# EAGLE design main (EAGLE 9.2.2)
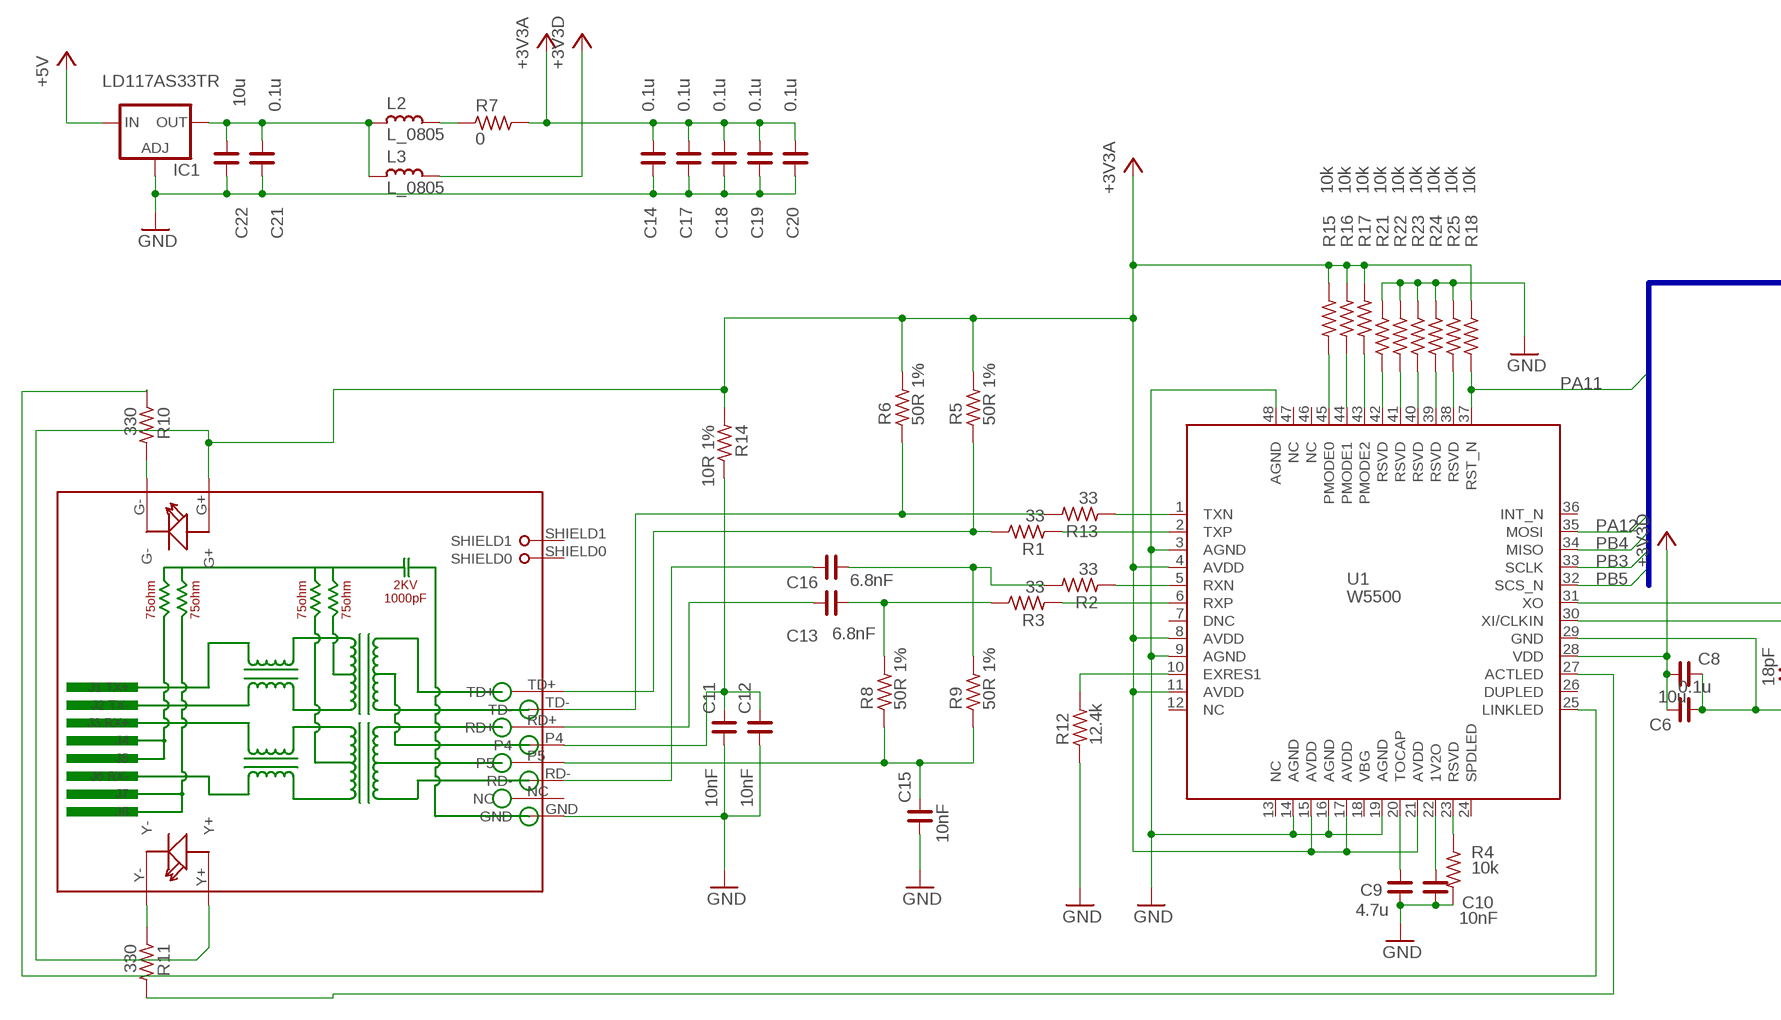
[diagram p0: schematic, sheet 1, part 1 of 2]
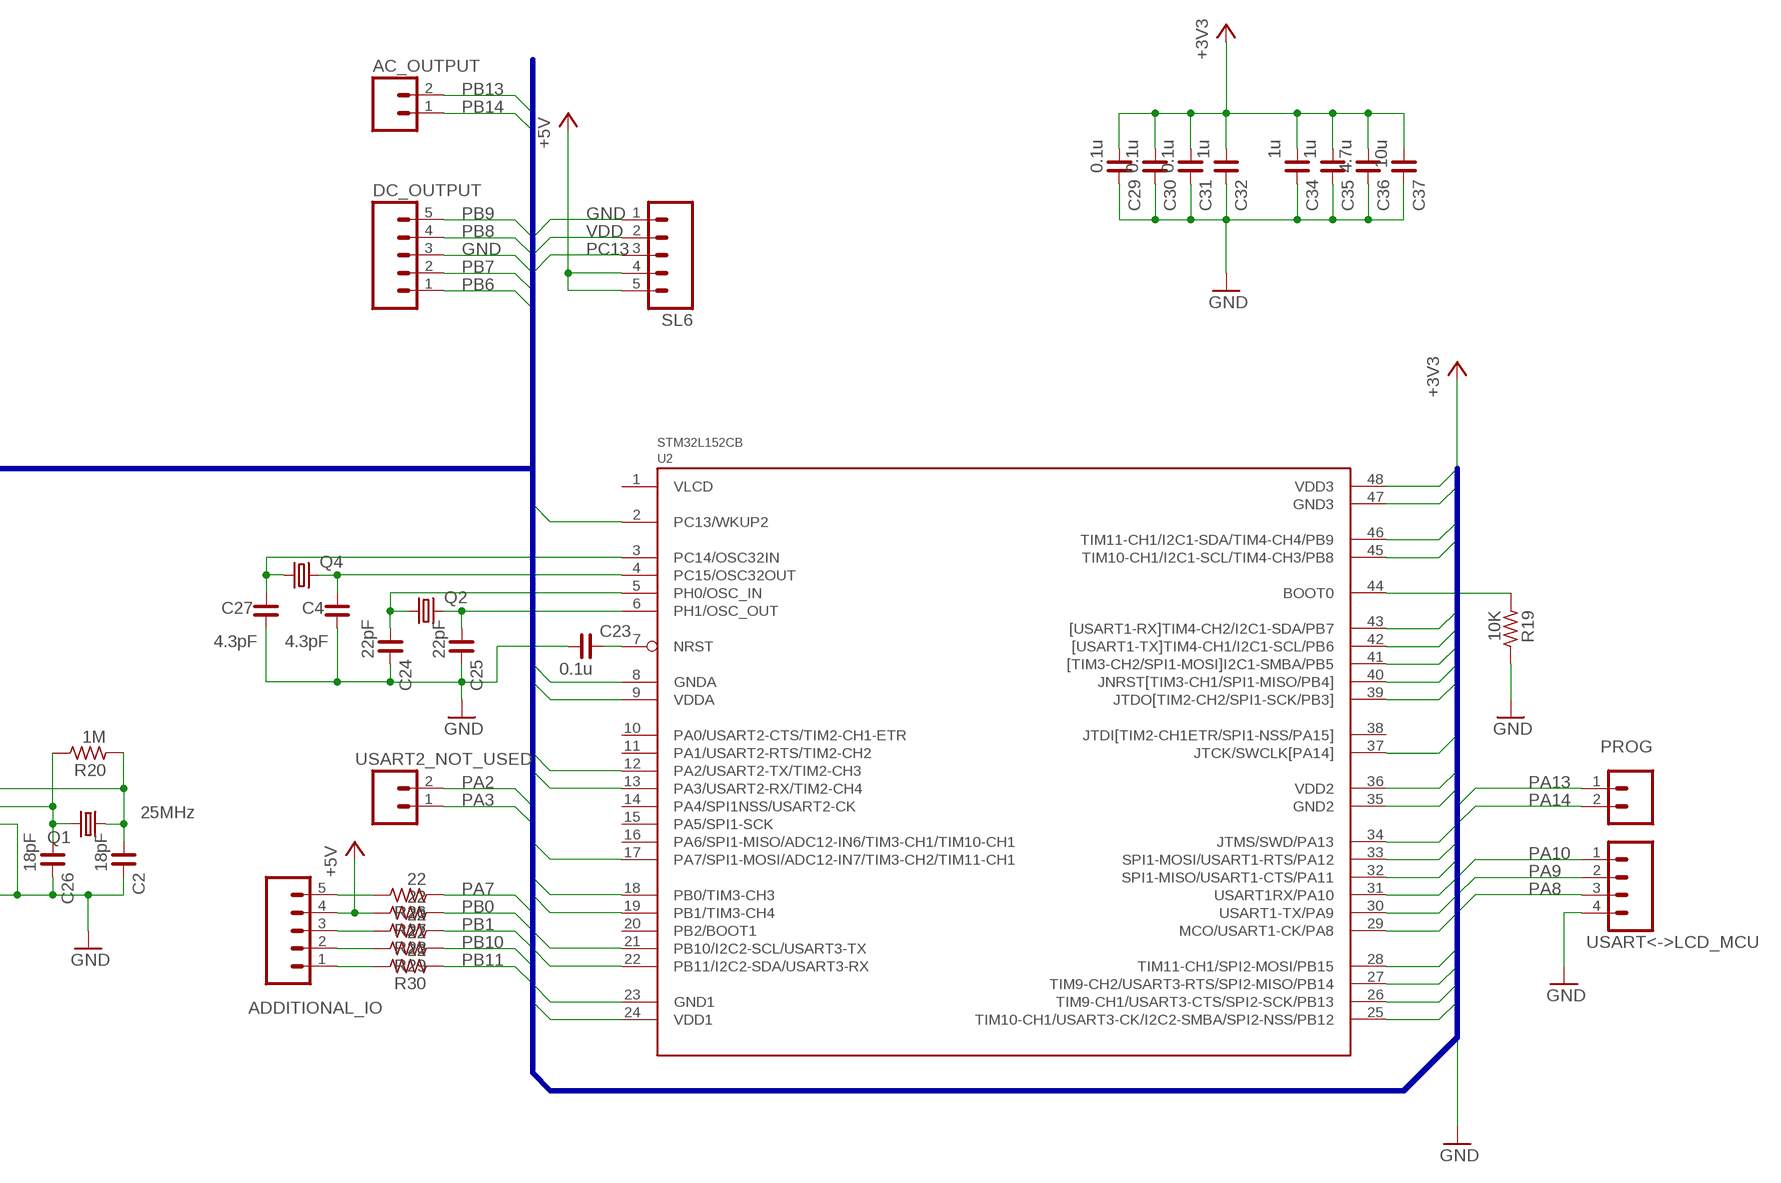
[diagram p1: schematic, sheet 1, part 2 of 2]

## Parts
AC_OUTPUT  M02  [02P]
ADDITIONAL_IO  M05  [05P]
C2  18pF  C_0603  [C0603]
C4  4.3pF  C_0603  [C0603]
C6  0.1u  C_0805  [C0805]
C8  10u  C_0805  [C0805]
C9  4.7u  C_0805  [C0805]
C10  10nF  C_0603  [C0603]
C11  10nF  C_0603  [C0603]
C12  10nF  C_0603  [C0603]
C13  6.8nF  C_0603  [C0603]
C14  0.1u  C_0805  [C0805]
C15  10nF  C_0603  [C0603]
C16  6.8nF  C_0603  [C0603]
C17  0.1u  C_0805  [C0805]
C18  0.1u  C_0805  [C0805]
C19  0.1u  C_0805  [C0805]
C20  0.1u  C_0805  [C0805]
C21  0.1u  C_0805  [C0805]
C22  10u  C_0805  [C0805]
C23  0.1u  C_0805  [C0805]
C24  22pF  C_0805  [C0805]
C25  22pF  C_0805  [C0805]
C26  18pF  C_0603  [C0603]
C27  4.3pF  C_0603  [C0603]
C29  0.1u  C_0805  [C0805]
C30  0.1u  C_0805  [C0805]
C31  0.1u  C_0805  [C0805]
C32  1u  C_0805  [C0805]
C34  1u  C_0805  [C0805]
C35  1u  C_0805  [C0805]
C36  4.7u  C_0805  [C0805]
C37  10u  C_0805  [C0805]
DC_OUTPUT  M05  [05P]
IC1  LD117AS33TR  [SOT223]
L2  L_0805  [L0805]
L3  L_0805  [L0805]
PROG  M02  [02P]
Q1  25MHz  CRYSTALHC49U-V  [HC49U-V]
Q2  CRYSTALHC49U-V  [HC49U-V]
Q4  CRYSTALTC26H  [TC26H]
R1  33  R_0603  [R0603]
R2  33  R_0603  [R0603]
R3  33  R_0603  [R0603]
R4  10k  R_0603  [R0603]
R5  50R 1%  R_0603  [R0603]
R6  50R 1%  R_0603  [R0603]
R7  0  R_1206  [R1206]
R8  50R 1%  R_0603  [R0603]
R9  50R 1%  R_0603  [R0603]
R10  330  R_0805  [R0805]
R11  330  R_0805  [R0805]
R12  12.4k  R_0805  [R0805]
R13  33  R_0603  [R0603]
R14  10R 1%  R_0603  [R0603]
R15  10k  R_0603  [R0603]
R16  10k  R_0603  [R0603]
R17  10k  R_0603  [R0603]
R18  10k  R_0603  [R0603]
R19  10K  R_1206  [R1206]
R20  1M  R_0805  [R0805]
R21  10k  R_0603  [R0603]
R22  10k  R_0603  [R0603]
R23  10k  R_0603  [R0603]
R24  10k  R_0603  [R0603]
R25  10k  R_0603  [R0603]
R26  22  R_0805  [R0805]
R27  22  R_0805  [R0805]
R28  22  R_0805  [R0805]
R29  22  R_0805  [R0805]
R30  22  R_0805  [R0805]
RJ1  HR911105A  [HR911105A]
SL6  M05  [05P]
U1  W5500  [W5500]
U2  STM32L152CB  [LQFP48-7X7]
USART2_NOT_USED  M02  [02P]
USART<->LCD_MCU  M04  [04P]

## Nets
+3V3A: C14.1 C17.1 C18.1 C19.1 C20.1 R5.2 R6.2 R7.2 R14.1 R15.2 R16.2 R17.2 R18.2 RJ1.G+ RJ1.Y+ U1.4(AVDD) U1.8(AVDD) U1.11(AVDD) U1.15(AVDD) U1.17(AVDD) U1.21(AVDD)
+3V3D: C6.2 C8.1 L3.1 U1.28(VDD)
+5V: ADDITIONAL_IO.4 IC1.3(IN) R27.2 SL6.4 SL6.5
GND: C2.2 C4.1 C6.1 C8.2 C9.2 C10.1 C11.1 C12.1 C14.2 C15.1 C17.2 C18.2 C19.2 C20.2 C21.2 C22.2 C23.1 C24.2 C25.2 C26.2 C27.1 C29.2 C30.2 C31.2 C32.2 C34.2 C35.2 C36.2 C37.2 DC_OUTPUT.3 IC1.1(ADJ) R4.2 R12.1 R19.2 R21.2 R22.2 R23.2 R24.2 R25.2 RJ1.GND SL6.1 U1.3(AGND) U1.9(AGND) U1.14(AGND) U1.16(AGND) U1.19(AGND) U1.29(GND) U1.48(AGND) U2.8(GNDA) U2.23(GND1) U2.35(GND2) U2.47(GND3) USART<->LCD_MCU.4
N$1: C9.1 U1.20(TOCAP)
N$2: C10.2 U1.22(1V2O)
N$3: R13.1 U1.1(TXN)
N$4: C2.1 Q1.1 R20.1 U1.31(XO)
N$5: C26.1 Q1.2 R20.2 U1.30(XI/CLKIN)
N$6: R1.1 U1.2(TXP)
N$7: R2.1 U1.5(RXN)
N$8: R3.1 U1.6(RXP)
N$9: R4.1 U1.23(RSVD)
N$10: C21.1 C22.1 IC1.4(OUT) L2.2 L3.2
N$11: C16.1 R2.2 R9.2
N$12: C13.1 R3.2 R8.2
N$13: L2.1 R7.1
N$14: R10.2 RJ1.G-
N$15: C11.2 C12.2 R14.2 RJ1.P4
N$16: R11.1 RJ1.Y-
N$17: R6.1 R13.2 RJ1.TD-
N$18: C13.2 RJ1.RD+
N$19: R10.1 U1.25(LINKLED)
N$20: R11.2 U1.27(ACTLED)
N$21: R16.1 U1.44(PMODE1)
N$22: R15.1 U1.45(PMODE0)
N$23: R17.1 U1.43(PMODE2)
N$24: C16.2 RJ1.RD-
N$25: R12.2 U1.10(EXRES1)
N$26: R1.2 R5.1 RJ1.TD+
N$27: C15.2 R8.1 R9.1 RJ1.P5
N$28: ADDITIONAL_IO.5 R26.2
N$29: C23.2 U2.7(NRST)
N$31: R19.1 U2.44(BOOT0)
N$32: C27.2 Q4.1 U2.3(PC14/OSC32IN)
N$33: C24.1 Q2.1 U2.5(PH0/OSC_IN)
N$34: C25.1 Q2.2 U2.6(PH1/OSC_OUT)
N$35: C4.2 Q4.2 U2.4(PC15/OSC32OUT)
N$36: ADDITIONAL_IO.3 R28.2
N$37: ADDITIONAL_IO.2 R29.2
N$38: R21.1 U1.42(RSVD)
N$39: R22.1 U1.41(RSVD)
N$40: R23.1 U1.40(RSVD)
N$41: R24.1 U1.39(RSVD)
N$42: R25.1 U1.38(RSVD)
N$43: ADDITIONAL_IO.1 R30.2
PA2: U2.12(PA2/USART2-TX/TIM2-CH3) USART2_NOT_USED.2
PA3: U2.13(PA3/USART2-RX/TIM2-CH4) USART2_NOT_USED.1
PA7: R26.1 U2.17(PA7/SPI1-MOSI/ADC12-IN7/TIM3-CH2/TIM11-CH1)
PA8: U2.29(MCO/USART1-CK/PA8) USART<->LCD_MCU.3
PA9: U2.30(USART1-TX/PA9) USART<->LCD_MCU.2
PA10: U2.31(USART1RX/PA10) USART<->LCD_MCU.1
PA11: R18.1 U1.37(RST_N) U2.32(SPI1-MISO/USART1-CTS/PA11)
PA12: U1.35(MOSI) U2.33(SPI1-MOSI/USART1-RTS/PA12)
PA13: PROG.1 U2.34(JTMS/SWD/PA13)
PA14: PROG.2 U2.37(JTCK/SWCLK[PA14])
PB0: R27.1 U2.18(PB0/TIM3-CH3)
PB1: R28.1 U2.19(PB1/TIM3-CH4)
PB3: U1.33(SCLK) U2.39(JTDO[TIM2-CH2/SPI1-SCK/PB3])
PB4: U1.34(MISO) U2.40(JNRST[TIM3-CH1/SPI1-MISO/PB4])
PB5: U1.32(SCS_N) U2.41([TIM3-CH2/SPI1-MOSI]I2C1-SMBA/PB5)
PB6: DC_OUTPUT.1 U2.42([USART1-TX]TIM4-CH1/I2C1-SCL/PB6)
PB7: DC_OUTPUT.2 U2.43([USART1-RX]TIM4-CH2/I2C1-SDA/PB7)
PB8: DC_OUTPUT.4 U2.45(TIM10-CH1/I2C1-SCL/TIM4-CH3/PB8)
PB9: DC_OUTPUT.5 U2.46(TIM11-CH1/I2C1-SDA/TIM4-CH4/PB9)
PB10: R29.1 U2.21(PB10/I2C2-SCL/USART3-TX)
PB11: R30.1 U2.22(PB11/I2C2-SDA/USART3-RX)
PB12: U2.25(TIM10-CH1/USART3-CK/I2C2-SMBA/SPI2-NSS/PB12)
PB13: AC_OUTPUT.2 U2.26(TIM9-CH1/USART3-CTS/SPI2-SCK/PB13)
PB14: AC_OUTPUT.1 U2.27(TIM9-CH2/USART3-RTS/SPI2-MISO/PB14)
PB15: U2.28(TIM11-CH1/SPI2-MOSI/PB15)
PC13: SL6.3 U2.2(PC13/WKUP2)
VDD: C29.1 C30.1 C31.1 C32.1 C34.1 C35.1 C36.1 C37.1 SL6.2 U2.9(VDDA) U2.24(VDD1) U2.36(VDD2) U2.48(VDD3) ; supply symbol labelled +3V3
Unconnected: RJ1.NC RJ1.SHIELD0 RJ1.SHIELD1 U1.7(DNC) U1.12(NC) U1.13(NC) U1.18(VBG) U1.24(SPDLED) U1.26(DUPLED) U1.36(INT_N) U1.46(NC) U1.47(NC) U2.1(VLCD) U2.10(PA0/USART2-CTS/TIM2-CH1-ETR) U2.11(PA1/USART2-RTS/TIM2-CH2) U2.14(PA4/SPI1NSS/USART2-CK) U2.15(PA5/SPI1-SCK) U2.16(PA6/SPI1-MISO/ADC12-IN6/TIM3-CH1/TIM10-CH1) U2.20(PB2/BOOT1) U2.38(JTDI[TIM2-CH1ETR/SPI1-NSS/PA15])

## Buses
VDD,GND,PA[0..15],PB[0..15],PC13

## Library data of the parts
AC_OUTPUT PROG USART2_NOT_USED = con-amp-quick:M02: AMP QUICK CONNECTOR; OC_FARNELL: unknown; OC_NEWARK: unknown
ADDITIONAL_IO DC_OUTPUT SL6 = con-amp-quick:M05: AMP QUICK CONNECTOR; OC_FARNELL: unknown; OC_NEWARK: unknown
C2 C4 C6 C8-C27 C29-C32 C34-C37 = rc-master-smd:C_: NON-POLARIZED CAP
IC1 = v-reg:LD117A?*: Low drop fixed and adjustable positive voltage regulators 1 A Source: http://www.st.com/stonline/products/literature/ds/7194/ld1117axx.pdf
L2 L3 = rc-master-smd:L_: INDUCTOR
Q1 Q2 = crystal:CRYSTAL: CRYSTAL; OC_FARNELL: 1666969; OC_NEWARK: unknown
Q4 = crystal:CRYSTAL: CRYSTAL; OC_FARNELL: unknown; OC_NEWARK: unknown
R1-R30 = rc-master-smd:R_: RESISTOR
RJ1 = CONNECTER:HR911105A
U1 = W5500:W5500
U2 = stm32:STM32L152CB
USART<->LCD_MCU = con-amp-quick:M04: AMP QUICK CONNECTOR; OC_FARNELL: unknown; OC_NEWARK: unknown

## Board
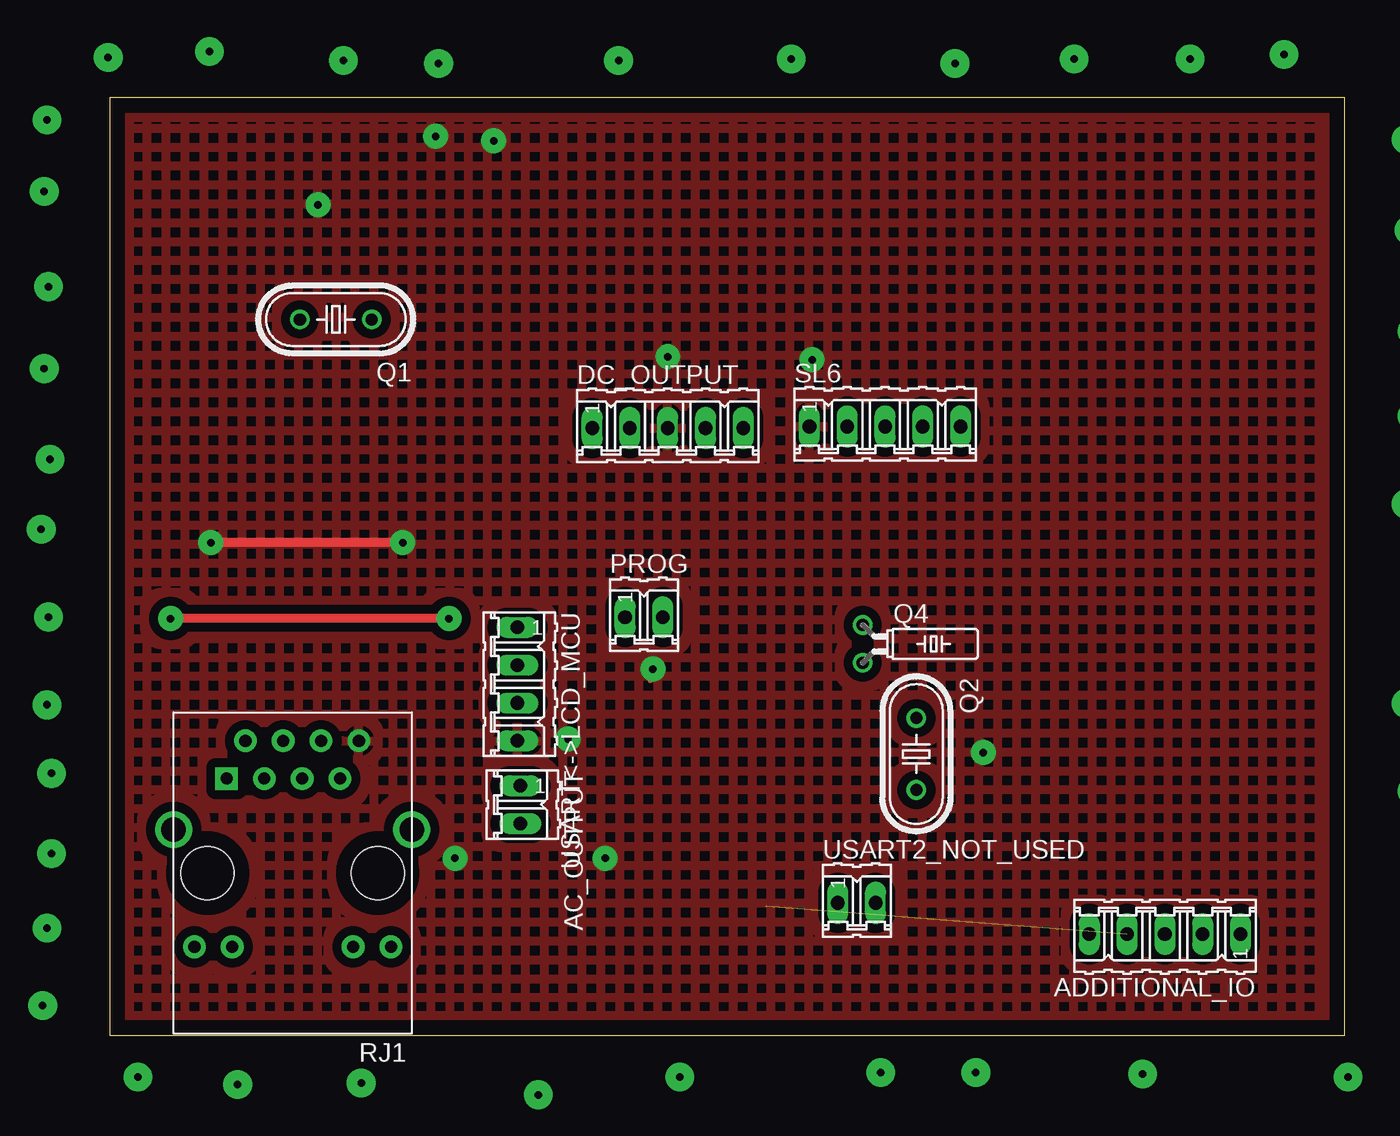
[diagram p2: board, top side]
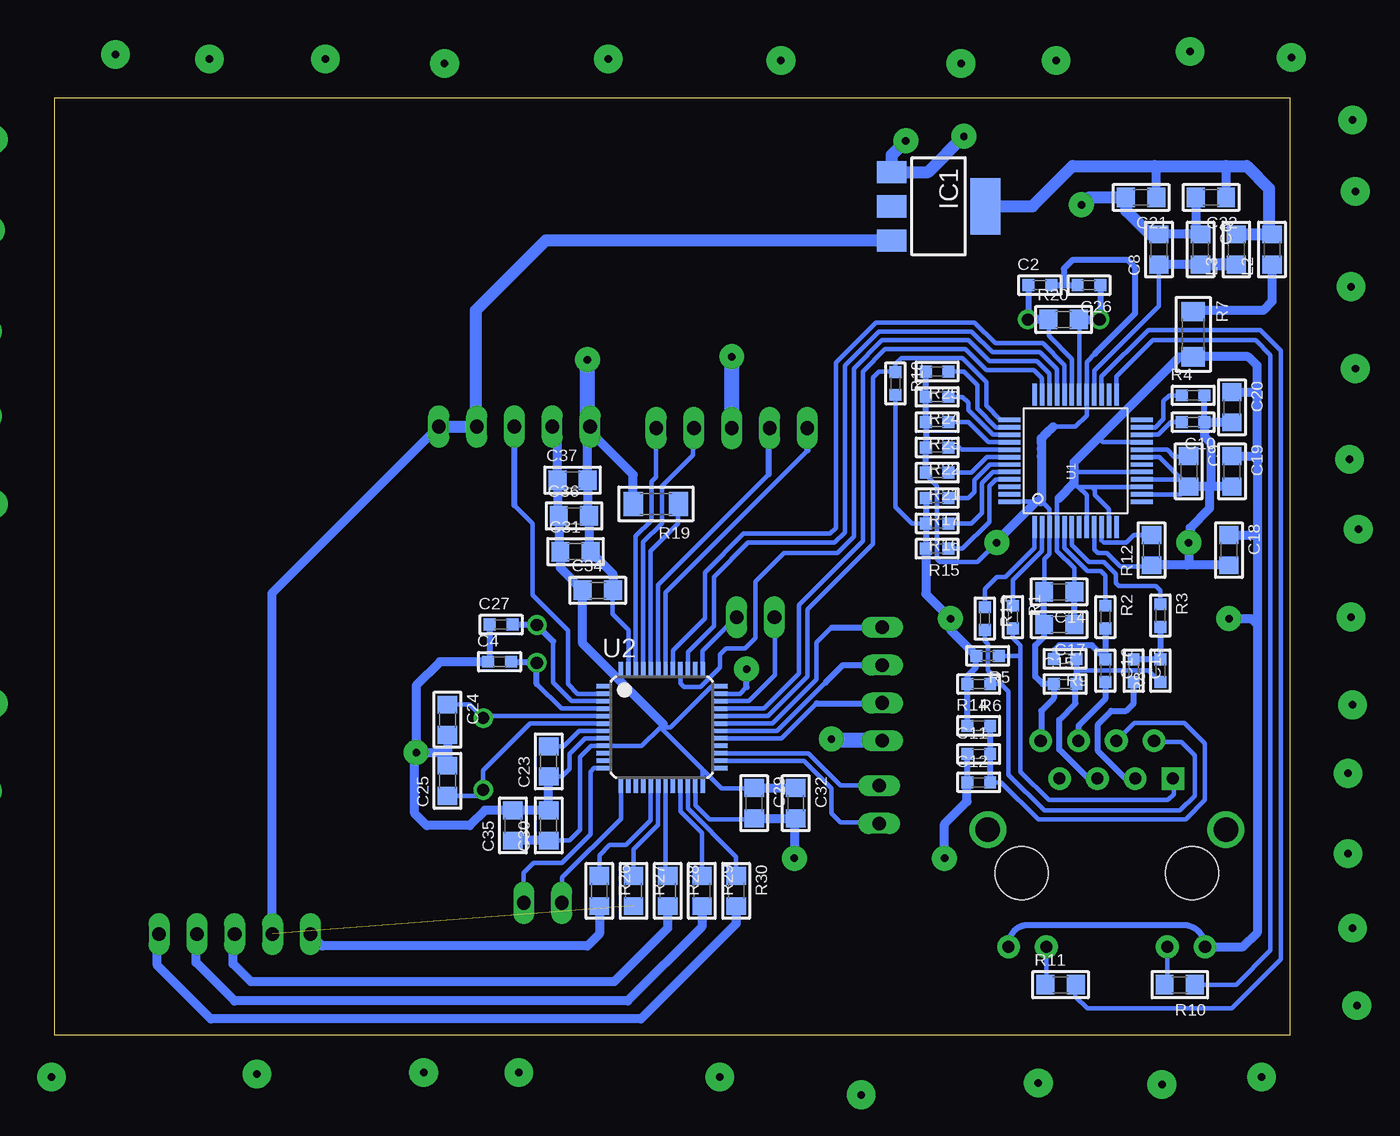
[diagram p3: board, bottom side, seen from below]

Size 83 x 63 mm. Coordinates in mm from the lower left corner, seen from the top.
Outline: 0,0 83,0 83,63 0,63 0,0
Copper layers (1*16): Top 0.035mm / dielectric 1.5mm / Bottom 0.035mm
Design rules "default": minimum track width 10mil, minimum drill 24mil, track to track 8mil, track to pad 8mil, pad to pad 8mil, via to via 8mil, smd to smd 8mil, copper to edge 40mil, drill to drill 8mil, minimum pad ring 10mil, minimum via ring 8mil, stop-mask expansion 4mil, vias tented up to drill 0mil, thermal gap 10mil

### Footprints (pad centres in the part's own frame; a part is rotated, then mirrored left to right if it is on the bottom)
02P = drill 0.914 long: 1 -1.27,0; 2 1.27,0
05P = drill 0.914 long: 1 -5.08,0; 2 -2.54,0; 3 0,0; 4 2.54,0; 5 5.08,0
C0603 = smd 0.8 x 0.8: 1 -0.762,0; 2 0.762,0
C0805 = smd 1.2 x 1.3: 1 -1.016,0; 2 1.016,0
SOT223 = smd 1.5 x 2: 1 -2.3,-3.15; 2 0,-3.15; 3 2.3,-3.15 | smd 3.8 x 2: 4 0,3.15
L0805 = smd 1.2 x 1.3: 1 -1.016,0; 2 1.016,0
HC49U-V = drill 0.813: 1 -2.413,0; 2 2.413,0
TC26H = drill 0.813: 1 -1.27,0; 2 1.27,0
R0603 = smd 0.8 x 0.8: 1 -0.762,0; 2 0.762,0
R1206 = smd 1.3 x 1.6: 1 -1.524,0; 2 1.524,0
R0805 = smd 1.2 x 1.3: 1 -1.016,0; 2 1.016,0
HR911105A = drill 0.813 pad 1.524: G+ 4.953,-6.604; G- 4.953,-4.064; GND -8.89,4.445; NC -6.35,3.175; P4 -8.89,-0.635; P5 -6.35,0.635; RD+ -6.35,-1.905; RD- -8.89,1.905; TD- -8.89,-3.175; Y+ 4.953,6.604; Y- 4.953,4.064 | drill 1.651 pad 2.159: SHIELD0 -2.921,8.001; SHIELD1 -2.921,-8.001 | drill 0.813 pad 1.524 square: TD+ -6.35,-4.445 | hole 3.556: 0,-5.715; 0,5.715
W5500 = smd 1.5 x 0.3: 1 -4.45,2.75; 2 -4.45,2.25; 3 -4.45,1.75; 4 -4.45,1.25; 5 -4.45,0.75; 6 -4.45,0.25; 7 -4.45,-0.25; 8 -4.45,-0.75; 9 -4.45,-1.25; 10 -4.45,-1.75; 11 -4.45,-2.25; 12 -4.45,-2.75; 25 4.45,-2.75; 26 4.45,-2.25; 27 4.45,-1.75; 28 4.45,-1.25; 29 4.45,-0.75; 30 4.45,-0.25; 31 4.45,0.25; 32 4.45,0.75; 33 4.45,1.25; 34 4.45,1.75; 35 4.45,2.25; 36 4.45,2.75 | smd 0.3 x 1.5: 13 -2.75,-4.45; 14 -2.25,-4.45; 15 -1.75,-4.45; 16 -1.25,-4.45; 17 -0.75,-4.45; 18 -0.25,-4.45; 19 0.25,-4.45; 20 0.75,-4.45; 21 1.25,-4.45; 22 1.75,-4.45; 23 2.25,-4.45; 24 2.75,-4.45; 37 2.75,4.45; 38 2.25,4.45; 39 1.75,4.45; 40 1.25,4.45; 41 0.75,4.45; 42 0.25,4.45; 43 -0.25,4.45; 44 -0.75,4.45; 45 -1.25,4.45; 46 -1.75,4.45; 47 -2.25,4.45; 48 -2.75,4.45
LQFP48-7X7 = smd 0.9 x 0.3: 1 -3.95,2.75; 2 -3.95,2.25; 3 -3.95,1.75; 4 -3.95,1.25; 5 -3.95,0.75; 6 -3.95,0.25; 7 -3.95,-0.25; 8 -3.95,-0.75; 9 -3.95,-1.25; 10 -3.95,-1.75; 11 -3.95,-2.25; 12 -3.95,-2.75; 25 3.95,-2.75; 26 3.95,-2.25; 27 3.95,-1.75; 28 3.95,-1.25; 29 3.95,-0.75; 30 3.95,-0.25; 31 3.95,0.25; 32 3.95,0.75; 33 3.95,1.25; 34 3.95,1.75; 35 3.95,2.25; 36 3.95,2.75 | smd 0.3 x 0.9: 13 -2.75,-3.95; 14 -2.25,-3.95; 15 -1.75,-3.95; 16 -1.25,-3.95; 17 -0.75,-3.95; 18 -0.25,-3.95; 19 0.25,-3.95; 20 0.75,-3.95; 21 1.25,-3.95; 22 1.75,-3.95; 23 2.25,-3.95; 24 2.75,-3.95; 37 2.75,3.95; 38 2.25,3.95; 39 1.75,3.95; 40 1.25,3.95; 41 0.75,3.95; 42 0.25,3.95; 43 -0.25,3.95; 44 -0.75,3.95; 45 -1.25,3.95; 46 -1.75,3.95; 47 -2.25,3.95; 48 -2.75,3.95
04P = drill 0.914 long: 1 -3.81,0; 2 -1.27,0; 3 1.27,0; 4 3.81,0

### Placement (x,y rotation side)
AC_OUTPUT  27.6,15.5 270 top
ADDITIONAL_IO  70.9,6.8 180 top
C2  16.8,50.4 0 bottom
C4  53.1,25.1 0 bottom
C6  6,52.8 270 bottom
C8  8.8,52.8 90 bottom
C9  6.8,37.9 270 bottom
C10  6.5,41.2 180 bottom
C11  20.9,18.9 0 bottom
C12  20.9,17 0 bottom
C13  10.5,24.5 270 bottom
C14  15.5,29.8 180 bottom
C15  15.1,23.6 0 bottom
C16  12.4,24.5 270 bottom
C17  15.5,27.6 180 bottom
C18  4.1,32.6 270 bottom
C19  3.9,37.9 270 bottom
C20  3.9,42.2 270 bottom
C21  10,56.3 180 bottom
C22  5.3,56.3 180 bottom
C23  49.8,18.4 90 bottom
C24  56.6,21.2 270 bottom
C25  56.6,17.1 90 bottom
C26  13.5,50.4 180 bottom
C27  53,27.6 0 bottom
C29  36,15.6 270 bottom
C30  49.8,14.1 90 bottom
C31  48,32.5 0 bottom
C32  33.2,15.6 270 bottom
C34  46.5,29.9 0 bottom
C35  52.2,14.1 90 bottom
C36  48.1,34.9 0 bottom
C37  48.2,37.3 0 bottom
DC_OUTPUT  37.5,40.8 0 top
IC1  23.6,55.7 270 bottom
L2  1.2,52.8 90 bottom
L3  3.6,52.8 90 bottom
PROG  35.9,28.1 0 top
Q1  15.2,48.1 180 top
Q2  54.2,18.9 270 top
Q4  50.6,26.3 270 top
R1  18.6,28.1 270 bottom
R2  12.4,28.1 270 bottom
R3  8.7,28.2 270 bottom
R4  6.5,43 0 bottom
R5  20.3,25.5 180 bottom
R6  20.9,23.6 180 bottom
R7  6.5,47.1 270 bottom
R8  8.7,24.5 90 bottom
R9  15.1,25.3 180 bottom
R10  7.4,3.4 180 bottom
R11  15.4,3.4 0 bottom
R12  9.3,32.6 90 bottom
R13  20.5,28 270 bottom
R14  20.9,20.8 0 bottom
R15  23.7,32.7 180 bottom
R16  23.7,34.4 180 bottom
R17  23.7,36.1 180 bottom
R18  26.5,43.8 270 bottom
R19  42.6,35.7 180 bottom
R20  15.2,48.1 0 bottom
R21  23.7,37.8 180 bottom
R22  23.7,39.5 180 bottom
R23  23.7,41.2 180 bottom
R24  23.7,42.9 180 bottom
R25  23.7,44.6 180 bottom
R26  46.4,9.7 270 bottom
R27  44.1,9.7 270 bottom
R28  41.8,9.7 270 bottom
R29  39.5,9.7 270 bottom
R30  37.2,9.7 270 bottom
RJ1  12.3,10.9 270 top
SL6  52.1,40.9 0 top
U1  14.4,38.6 90 bottom
U2  42.2,20.7 0 bottom
USART2_NOT_USED  50.2,8.9 0 top
USART<->LCD_MCU  27.4,23.6 270 top

### Tracks (layer width: path | path; a pad name or v marks a point on that pad's centre or on a via)
+3V3A  (via drill 0.5 pad 1.68)
  Top 0.61: v22.8,28 v4.1,28
  Bottom 0.305: 15.5,36.1 15.65,35.95 U1.4 15.65,32.55 14.48,31.38 C14.1 | U1.17 14.35,37.85 14.5,37.7 | U1.21 12.55,39.85 12.85,40.15 | U1.15 13.3,36.85 | 13.3,36.85 14.2,36.85 | 14.2,36.85 14.25,36.85 14.5,37.1 | U1.8 13.65,36.3 14.2,36.85 | U1.11 12.15,35.35 13.1,36.3 13.1,36.65 13.3,36.85 | R18.2 26.5,35.5 25.4,34.4 R16.2
  Bottom 0.406: RJ1.G+ arc-90 7.15,7.4 17.6,7.4 arc-90 18.9,6.1 RJ1.Y+ | C17.1 C14.1 | R14.1 R6.2 21.66,24.14 21.1,24.7 21.1,25.46 R5.2 | R17.2 R16.2 R15.2
  Bottom 0.61: RJ1.G+ 3.15,5.95 2.2,6.9 2.2,27.6 | 2.2,38.8 2.2,43.1 | 2.2,43.1 2.2,45 2.8,45.6 6.48,45.6 R7.2 7.42,45.58 12.85,40.15 14.5,38.5 14.5,37.7 14.5,37.1 15.5,36.1 | C19.1 2.32,38.92 2.2,38.8 | C20.1 2.32,43.22 2.2,43.1 | 2.2,38.8 2.2,33.7 | 2.2,33.7 2.2,27.6 | R5.2 22.8,27.24 v22.8,28 24.46,29.66 R15.2 | v4.1,28 2.6,28 2.2,27.6 | C18.1 2.28,33.62 2.2,33.7
+3V3D
  Bottom 0.305: U1.28 13.15,44.65 8.8,49 C8.1
  Bottom 0.61: C6.2 C8.1
  Bottom 0.813: L3.1 C6.2
+5V  (1 unrouted)
  Bottom 0.61: ADDITIONAL_IO.4 68.4,6.76 68.4,29.68 SL6.5
  Bottom 0.813: SL6.5 SL6.4 54.7,40.96 54.7,48.7 50,53.4 IC1.3
GND  (via drill 0.5 pad 1.68)
  Top 0.305: v36.5,24.6 36.3,23.8 36.4,23.9
  Top 0.61: v19.7,33.1 v6.8,33.1
  Top 0.813: v14,55.8 14.4,55.8
  Top 1.016: 37.5,45.3 v37.5,45.6
  Bottom 0.305: U1.19 8.77,38.85 C9.2 | 16.75,35.85 16.7,35.9 16.15,35.35 U1.3 16.15,32.35 16.5,32 16.5,29.82 C14.2 | 16.75,38.85 16.7,38.9 | 16.75,39.35 16.7,39.4 | 16.75,39.85 16.7,39.8 | 13.1,45.8 13.65,45.25 U1.29 13.65,41.65 14.4,40.9 15.9,40.9 15.95,40.85 | 16.85,39.85 16.7,40 | U1.14 7.33,36.35 C9.2 | U1.16 7.27,37.35 C9.2 | U1.48 17.25,35.85 17.2,35.8 17.2,35.7 | 16.45,40.35 16.35,40.45 | U1.9 13.15,32.65 12.9,32.4 12.3,32.4 11.4,31.5 9.38,31.5 R12.1 | R21.2 24.46,37.66 23.7,36.9 23.7,32 23.5,31.8 21,31.8 v19.7,33.1 | U2.47 44.45,27.25 45.5,28.3 45.5,29.88 C34.2 | U2.8 47.35,19.95 48.4,18.9 48.4,17.9 48.9,17.4 49.78,17.4 C23.1 | U2.23 39.95,15.45 39,14.5 36.08,14.5 C29.2 | U2.35 36.95,22.95 36.5,23.4
  Bottom 0.406: C10.1 R4.2 | RJ1.GND 16.7,19.84 16.7,21.8 15.86,22.64 C15.1 16.6,23.6 17.1,24.1 17.1,26.2 16.5,26.8 16.5,27.48 C17.2 C14.2 | C12.1 C11.1 | 13.1,45.8 10.4,48.5 10.4,51.6 10.9,52.1 14.6,52.1 15.2,51.5 15.2,50.4 | 15.2,50.4 C26.2 | C2.2 15.2,50.4 | R21.2 R22.2 R23.2 R24.2 R25.2 | C34.2 45.48,30.28 | C27.1 53.76,25.2 C4.1 | 36.5,23.4 v36.5,24.6
  Bottom 0.61: C8.2 C6.1 6.32,54.13 C22.2 | C19.2 5.4,36.88 | 5.4,36.88 C9.2 | C20.2 3.92,41.2 C10.1 5.74,40.24 5.3,39.8 5.3,36.98 5.4,36.88 | 16.7,35.9 16.7,38.9 16.7,39.4 16.7,39.8 16.7,40 16.7,40.1 16.35,40.45 15.9,40.9 | 16.75,35.85 17.05,35.85 17.2,35.7 19.7,33.2 v19.7,33.1 | 5.4,36.88 5.4,35.4 6.7,34.1 6.7,33.2 v6.8,33.1 6.8,31.68 6.9,31.58 | C18.2 6.9,31.58 | 6.9,31.58 R12.1 | v23.2,11.9 23.2,14.2 21.7,15.7 21.7,16.96 C12.1 | 47.18,40.74 C37.2 47.18,35 C36.2 47.08,32.6 C31.2 45.48,31 C34.2 | 47.18,40.74 SL6.1 | C23.1 C30.2 C35.2 54.08,15.12 55.1,14.1 58,14.1 58.8,14.9 58.8,18.6 58.4,19 | C29.2 C32.2 33.3,14.48 v33.3,11.9 | C4.1 57.1,25.1 58.7,23.5 58.7,19.6 58.7,19.3 58.4,19 | 58.4,19 57,19 56.7,18.7 56.7,18.22 C25.2 C24.2 | R19.2 44.12,37.68 47.18,40.74
  Bottom 0.813: v25.8,60.1 26.75,59.15 IC1.1 24.3,58 v21.9,60.4 | v14,55.8 13.5,56.3 C21.2 11,56.28 11,55.4 9.42,53.82 C8.2 | v58.7,19 58.7,19.6
  Bottom 1.016: 47.18,40.74 47.18,45.38 v47.2,45.4 | DC_OUTPUT.3 37.5,45.3
  other vias: 30.8,19.9
  pour Top (isolate 0.61, hatched): 15.7,0.7 82.1,0.8 82.3,61.9 0.5,62.3 0.5,0.7 10.9,0.8
N$1
  Bottom 0.305: U1.20 8.25,39.35 7.8,38.9 6.82,38.9 C9.1
N$2
  Bottom 0.305: U1.22 8.85,40.35 8,41.2 C10.2
N$3
  Bottom 0.305: U1.1 17.15,32.75 19.1,30.8 19.7,30.8 20.5,30 R13.1
N$4
  Bottom 0.305: U1.31 14.65,45.45 16.2,47 16.2,48.08 R20.1
  Bottom 0.406: C2.1 17.56,48.15 Q1.1
  Bottom 0.61: R20.1 Q1.1
N$5
  Bottom 0.305: U1.30 14.15,48.07 R20.2
  Bottom 0.406: C26.1 12.74,48.15 Q1.2
  Bottom 0.61: R20.2 Q1.2
N$6
  Bottom 0.305: U1.2 16.65,32.55 18.6,30.6 R1.1
N$7
  Bottom 0.305: U1.5 15.15,32.75 13.6,31.2 12.7,31.2 12.4,30.9 R2.1
N$8
  Bottom 0.305: U1.6 14.65,32.95 13.5,31.8 12.5,31.8 11.7,31 11.7,30.4 11.5,30.2 9,30.2 8.7,29.9 R3.1
N$9
  Bottom 0.305: U1.23 9.05,40.85 8.5,41.4 8.5,42.6 8.1,43 R4.1
N$10
  Bottom 0.61: C22.1 4.28,58.38 4.3,58.4 | C21.1 8.98,58.28 9.1,58.4
  Bottom 0.813: L3.2 L2.2 1.4,54.02 1.4,56.9 2.9,58.4 4.3,58.4 9.1,58.4 14.6,58.4 17.3,55.7 IC1.4
N$11
  Bottom 0.406: R2.2 C16.1 12.4,25.3 13.3,26.2 15.5,26.2 15.8,25.9 15.8,25.36 R9.2
N$12
  Bottom 0.406: C13.1 R8.2 R3.2
N$13
  Bottom 0.61: L2.1 1.2,49.3 1.8,48.7 6.42,48.7 R7.1
N$14
  Bottom 0.305: RJ1.G- 8.24,3.58 R10.2
N$15
  Bottom 0.305: RJ1.P4 10.46,21 7.1,21 5.7,19.6 5.7,15.8 7,14.5 16.9,14.5 19.4,17 C12.2
  Bottom 0.406: C12.2 C11.2 R14.2
N$16
  Bottom 0.305: RJ1.Y- 16.36,3.45 R11.1
N$17
  Bottom 0.305: RJ1.TD- 9.04,19.7 7.3,19.7 6.4,18.8 6.4,16.1 7.4,15.1 16.5,15.1 18.9,17.5 18.9,23.1 19.4,23.6 R6.1 20.1,23.64 20.1,24.3 20.3,24.5 20.3,26.3 20.5,26.5 R13.2
N$18
  Bottom 0.406: RJ1.RD+ 11.05,17.25 12.9,19.1 12.9,20.9 12,21.8 11,21.8 10.5,22.3 C13.2
N$19
  Bottom 0.305: U1.25 11.65,44.25 9.2,46.7 2.3,46.7 1.3,45.7 1.3,5.7 3.6,3.4 R10.1
N$20
  Bottom 0.305: U1.27 12.65,44.25 9.5,47.4 2,47.4 0.6,46 0.6,5.1 3.9,1.8 13.6,1.8 14.4,2.6 14.4,3.38 R11.2
N$21
  Bottom 0.305: U1.44 19.95,37.85 20.7,37.1 20.7,35.1 21.4,34.4 R16.1
N$22
  Bottom 0.305: U1.45 19.75,37.35 20.2,36.9 20.2,34.5 22,32.7 R15.1
N$23
  Bottom 0.305: U1.43 20.15,38.35 21.2,37.3 21.2,36.5 21.6,36.1 R17.1
N$24
  Bottom 0.406: C16.2 12.4,22.6 14.2,20.8 RJ1.RD-
N$25
  Bottom 0.305: U1.10 12.65,33.25 12.5,33.1 11,33.1 10.5,33.6 9.32,33.6 R12.2
N$26
  Bottom 0.305: 18.1,25.5 18.1,26.2 18.6,26.7 R1.2 | 18.1,25.5 18.1,17.7 16.2,15.8 8.2,15.8 7.8,16.2 7.8,17.2 RJ1.TD+ | R5.1 18.1,25.5
N$27
  Bottom 0.305: R8.1 8.74,23.74 9.5,24.5 14.34,24.5
  Bottom 0.406: R9.1 14.34,24.5 C15.2 14.4,23.54 14.4,22.3 15.5,21.2 15.5,19.2 13.55,17.25 RJ1.P5
N$28
  Bottom 0.61: R26.2 46.4,6.8 47.2,6 65.02,6 ADDITIONAL_IO.5
N$29
  Bottom 0.305: U2.7 47.75,20.45 48.8,19.4 49.78,19.4 C23.2
N$31
  Bottom 0.305: R19.1 41.1,35.68 41.1,34.4 42.95,32.55 U2.44
N$32
  Bottom 0.305: U2.3 48.25,22.45 49.5,23.7 49.5,26.47
  Bottom 0.406: 49.5,26.47 Q4.1 50.63,27.6 C27.2
N$33
  Bottom 0.305: U2.5 54.06,21.45 Q2.1 55.1,22.22 C24.1
N$34
  Bottom 0.305: U2.6 51.05,20.95 54.2,17.8 Q2.2 54.6,16.08 C25.1
N$35
  Bottom 0.305: U2.4 48.95,21.95 50.6,23.6
  Bottom 0.406: 50.6,23.6 Q4.2 50.67,25.1 C4.2
N$36
  Bottom 0.61: R28.2 41.8,7.2 45.4,3.6 69.8,3.6 71,4.8 71,6.7 ADDITIONAL_IO.3
N$37
  Bottom 0.61: R29.2 39.5,7.3 44.5,2.3 70.9,2.3 73.5,4.9 73.5,6.74 ADDITIONAL_IO.2
N$38
  Bottom 0.305: U1.42 20.35,38.85 21.4,37.8 R21.1
N$39
  Bottom 0.305: U1.41 22.05,39.35 22.2,39.5 R22.1
N$40
  Bottom 0.305: U1.40 20.25,39.85 21.6,41.2 R23.1
N$41
  Bottom 0.305: U1.39 19.95,40.35 21.6,42 21.6,42.5 22,42.9 R24.1
N$42
  Bottom 0.305: U1.38 19.75,40.85 21,42.1 21,43.7 21.9,44.6 R25.1
N$43
  Bottom 0.61: R30.2 37.2,7.5 43.6,1.1 72.5,1.1 76.1,4.7 76.1,6.68 ADDITIONAL_IO.1
N$44
  Bottom 1.016: 27.3,19.8 30.5,19.8
N$45  (via drill 0.5 pad 1.93)
  other vias: -4.2,61.5
N$46  (via drill 0.5 pad 1.93)
  other vias: -4.4,56.7
N$47  (via drill 0.5 pad 1.93)
  other vias: -4.1,50.3
N$48  (via drill 0.5 pad 1.93)
  other vias: -4.4,44.8
N$49  (via drill 0.5 pad 1.93)
  other vias: -4,38.7
N$50  (via drill 0.5 pad 1.93)
  other vias: -4.6,34
N$51  (via drill 0.5 pad 1.93)
  other vias: -4.1,28.1
N$52  (via drill 0.5 pad 1.93)
  other vias: -4.2,22.2
N$53  (via drill 0.5 pad 1.93)
  other vias: -3.9,17.6
N$54  (via drill 0.5 pad 1.93)
  other vias: -3.9,12.2
N$55  (via drill 0.5 pad 1.93)
  other vias: -4.2,7.2
N$56  (via drill 0.5 pad 1.93)
  other vias: -4.5,2
N$57  (via drill 0.5 pad 1.93)
  other vias: 87.1,60.2
N$58  (via drill 0.5 pad 1.93)
  other vias: 87.3,54.1
N$59  (via drill 0.5 pad 1.93)
  other vias: 87.5,47.3
N$60  (via drill 0.5 pad 1.93)
  other vias: 87.5,41.6
N$61  (via drill 0.5 pad 1.93)
  other vias: 87.1,35.7
N$62  (via drill 0.5 pad 1.93)
  other vias: 87.7,28.9
N$63  (via drill 0.5 pad 1.93)
  other vias: 87.1,22.3
N$64  (via drill 0.5 pad 1.93)
  other vias: 87.5,16.4
N$65  (via drill 0.5 pad 1.93)
  other vias: 87.7,10
N$66  (via drill 0.5 pad 1.93)
  other vias: 88.4,3.9
N$67  (via drill 0.5 pad 1.93)
  other vias: -0.1,65.7
N$68  (via drill 0.5 pad 1.93)
  other vias: 6.7,66.1
N$69  (via drill 0.5 pad 1.93)
  other vias: 15.7,65.5
N$70  (via drill 0.5 pad 1.93)
  other vias: 22.1,65.3
N$71  (via drill 0.5 pad 1.93)
  other vias: 34.2,65.5
N$72  (via drill 0.5 pad 1.93)
  other vias: 45.8,65.6
N$73  (via drill 0.5 pad 1.93)
  other vias: 56.8,65.3
N$74  (via drill 0.5 pad 1.93)
  other vias: 64.8,65.6
N$75  (via drill 0.5 pad 1.93)
  other vias: 72.6,65.6
N$76  (via drill 0.5 pad 1.93)
  other vias: 78.9,65.9
N$77  (via drill 0.5 pad 1.93)
  other vias: 1.9,-2.8
N$78  (via drill 0.5 pad 1.93)
  other vias: 8.6,-3.3
N$79  (via drill 0.5 pad 1.93)
  other vias: 16.9,-3.2
N$80  (via drill 0.5 pad 1.93)
  other vias: 28.8,-4
N$81  (via drill 0.5 pad 1.93)
  other vias: 38.3,-2.8
N$82  (via drill 0.5 pad 1.93)
  other vias: 51.8,-2.5
N$83  (via drill 0.5 pad 1.93)
  other vias: 58.2,-2.5
N$84  (via drill 0.5 pad 1.93)
  other vias: 69.4,-2.6
N$85  (via drill 0.5 pad 1.93)
  other vias: 83.2,-2.8
PA2
  Bottom 0.305: U2.12 46.75,17.95 47,17.7 47,13.5 48.9,11.6 50.8,11.6 51.5,10.9 51.5,8.93 USART2_NOT_USED.2
PA3
  Bottom 0.305: U2.13 44.95,14.55 48.9,10.6 48.9,8.93 USART2_NOT_USED.1
PA7
  Bottom 0.305: U2.17 42.95,14.45 44.6,12.8 45.7,12.8 46.4,12.1 R26.1
PA8
  Bottom 0.305: U2.29 34.15,19.95 31.8,22.3
  Bottom 0.406: 31.8,22.3 27.43,22.3 USART<->LCD_MCU.3
PA9
  Bottom 0.305: U2.30 34.45,20.45 31.2,23.7
  Bottom 0.406: 31.2,23.7 30.03,24.87 USART<->LCD_MCU.2
PA10
  Bottom 0.305: U2.31 34.75,20.95 31.8,23.9 31.8,26.4 30.8,27.4
  Bottom 0.406: 30.8,27.4 USART<->LCD_MCU.1
PA11
  Bottom 0.305: U1.37 19.45,41.35 20.4,42.3 20.4,43.9 22,45.5 26.1,45.5 26.5,45.1 R18.1 26.54,44.6 27.6,44.6 28,44.2 28,33 32.4,28.6 32.4,24.1 35.05,21.45 U2.32
PA12
  Bottom 0.305: U1.35 16.65,44.15 17.2,44.7 20.4,44.7 21.8,46.1 27.2,46.1 28.7,44.6 28.7,33.2 33,28.9 33,24.3 35.35,21.95 U2.33
PA13
  Bottom 0.305: U2.34 36.35,22.45 34.6,24.2 34.6,28.07 PROG.1
PA14
  Bottom 0.305: U2.37 39.45,25.82 PROG.2
PB0
  Bottom 0.305: U2.18 42.45,14.15 44.1,12.5 R27.1
PB1
  Bottom 0.305: U2.19 41.95,10.87 R28.1
PB3
  Bottom 0.305: U2.39 40.45,25.75 38.7,27.5 38.7,30.8 36.4,33.1 30.6,33.1 29.9,33.8 29.9,45 27.6,47.3 21.4,47.3 20,45.9 16.8,45.9 15.65,44.75 U1.33
PB4
  Bottom 0.305: U2.40 40.95,23.65 40.7,23.4 39.6,23.4 38.3,24.7 38.3,25.6 37.9,26 36.6,26 35.9,26.7 35.9,30.5 34,32.4 30.4,32.4 29.3,33.5 29.3,44.8 27.4,46.7 21.6,46.7 20.2,45.3 17,45.3 16.15,44.45 U1.34
PB5
  Bottom 0.305: U1.32 15.15,45.05 16.6,46.5 19.8,46.5 21.2,47.9 27.8,47.9 30.5,45.2 30.5,34.1 30.9,33.7 36.7,33.7 39.3,31.1 39.3,28 41.45,25.85 U2.41
PB6
  Bottom 0.305: U2.42 41.95,29.75 32.4,39.3
  Bottom 0.406: 32.4,39.3 32.4,40.78 DC_OUTPUT.1
PB7
  Bottom 0.305: U2.43 42.45,30.25 35,37.7
  Bottom 0.406: 35,37.7 35,40.76 DC_OUTPUT.2
PB8
  Bottom 0.305: DC_OUTPUT.4 40.1,40.74 40.1,39 42.2,36.9 42.2,34.4 43.45,33.15 U2.45
PB9
  Bottom 0.305: DC_OUTPUT.5 42.6,40.78 42.6,37.5 42.9,37.2 42.9,34.6 43.95,33.55 U2.46
PB10
  Bottom 0.305: U2.21 40.95,15.05 39.5,13.6 R29.1
PB11
  Bottom 0.305: U2.22 40.45,15.25 37.2,12 R30.1
PB13
  Bottom 0.305: U2.26 32.65,18.45 30.8,16.6 30.8,14.9 30.2,14.3 27.67,14.3 AC_OUTPUT.2
PB14
  Bottom 0.305: U2.27 32.35,18.95 30.2,16.8 27.63,16.8 AC_OUTPUT.1
PC13
  Bottom 0.305: U2.2 47.85,22.95 48.5,23.6 48.5,27.2 50.9,29.6 50.9,34.4 52.1,35.6
  Bottom 0.406: 52.1,35.6 SL6.3
VDD
  Bottom 0.305: 42.3,20.7 43.55,19.45 U2.9 46.95,19.45 47.7,18.7 47.7,13.8 48.4,13.1 49.78,13.1 C30.1 | 42.3,20.7 42.15,20.85 | 42.15,20.85 42.1,20.9 | 42.3,20.7 39.45,17.85 U2.24 39.45,17.75 39.4,17.8 38.2,16.6 36.02,16.6 C29.1 | U2.36 38.85,23.45 41.6,20.7 42,20.7 42.15,20.85 | U2.48 44.95,23.85 45,23.8
  Bottom 0.61: 42.1,20.9 45,23.8 47.52,26.32 C34.1 49.02,31.4 C31.1 49.12,32.6 C36.1 49.22,35 C37.1 49.22,40.56 SL6.2 | C30.1 C35.1 | C29.1 C32.1